# Altium project MPD_NEW.PrjPcb
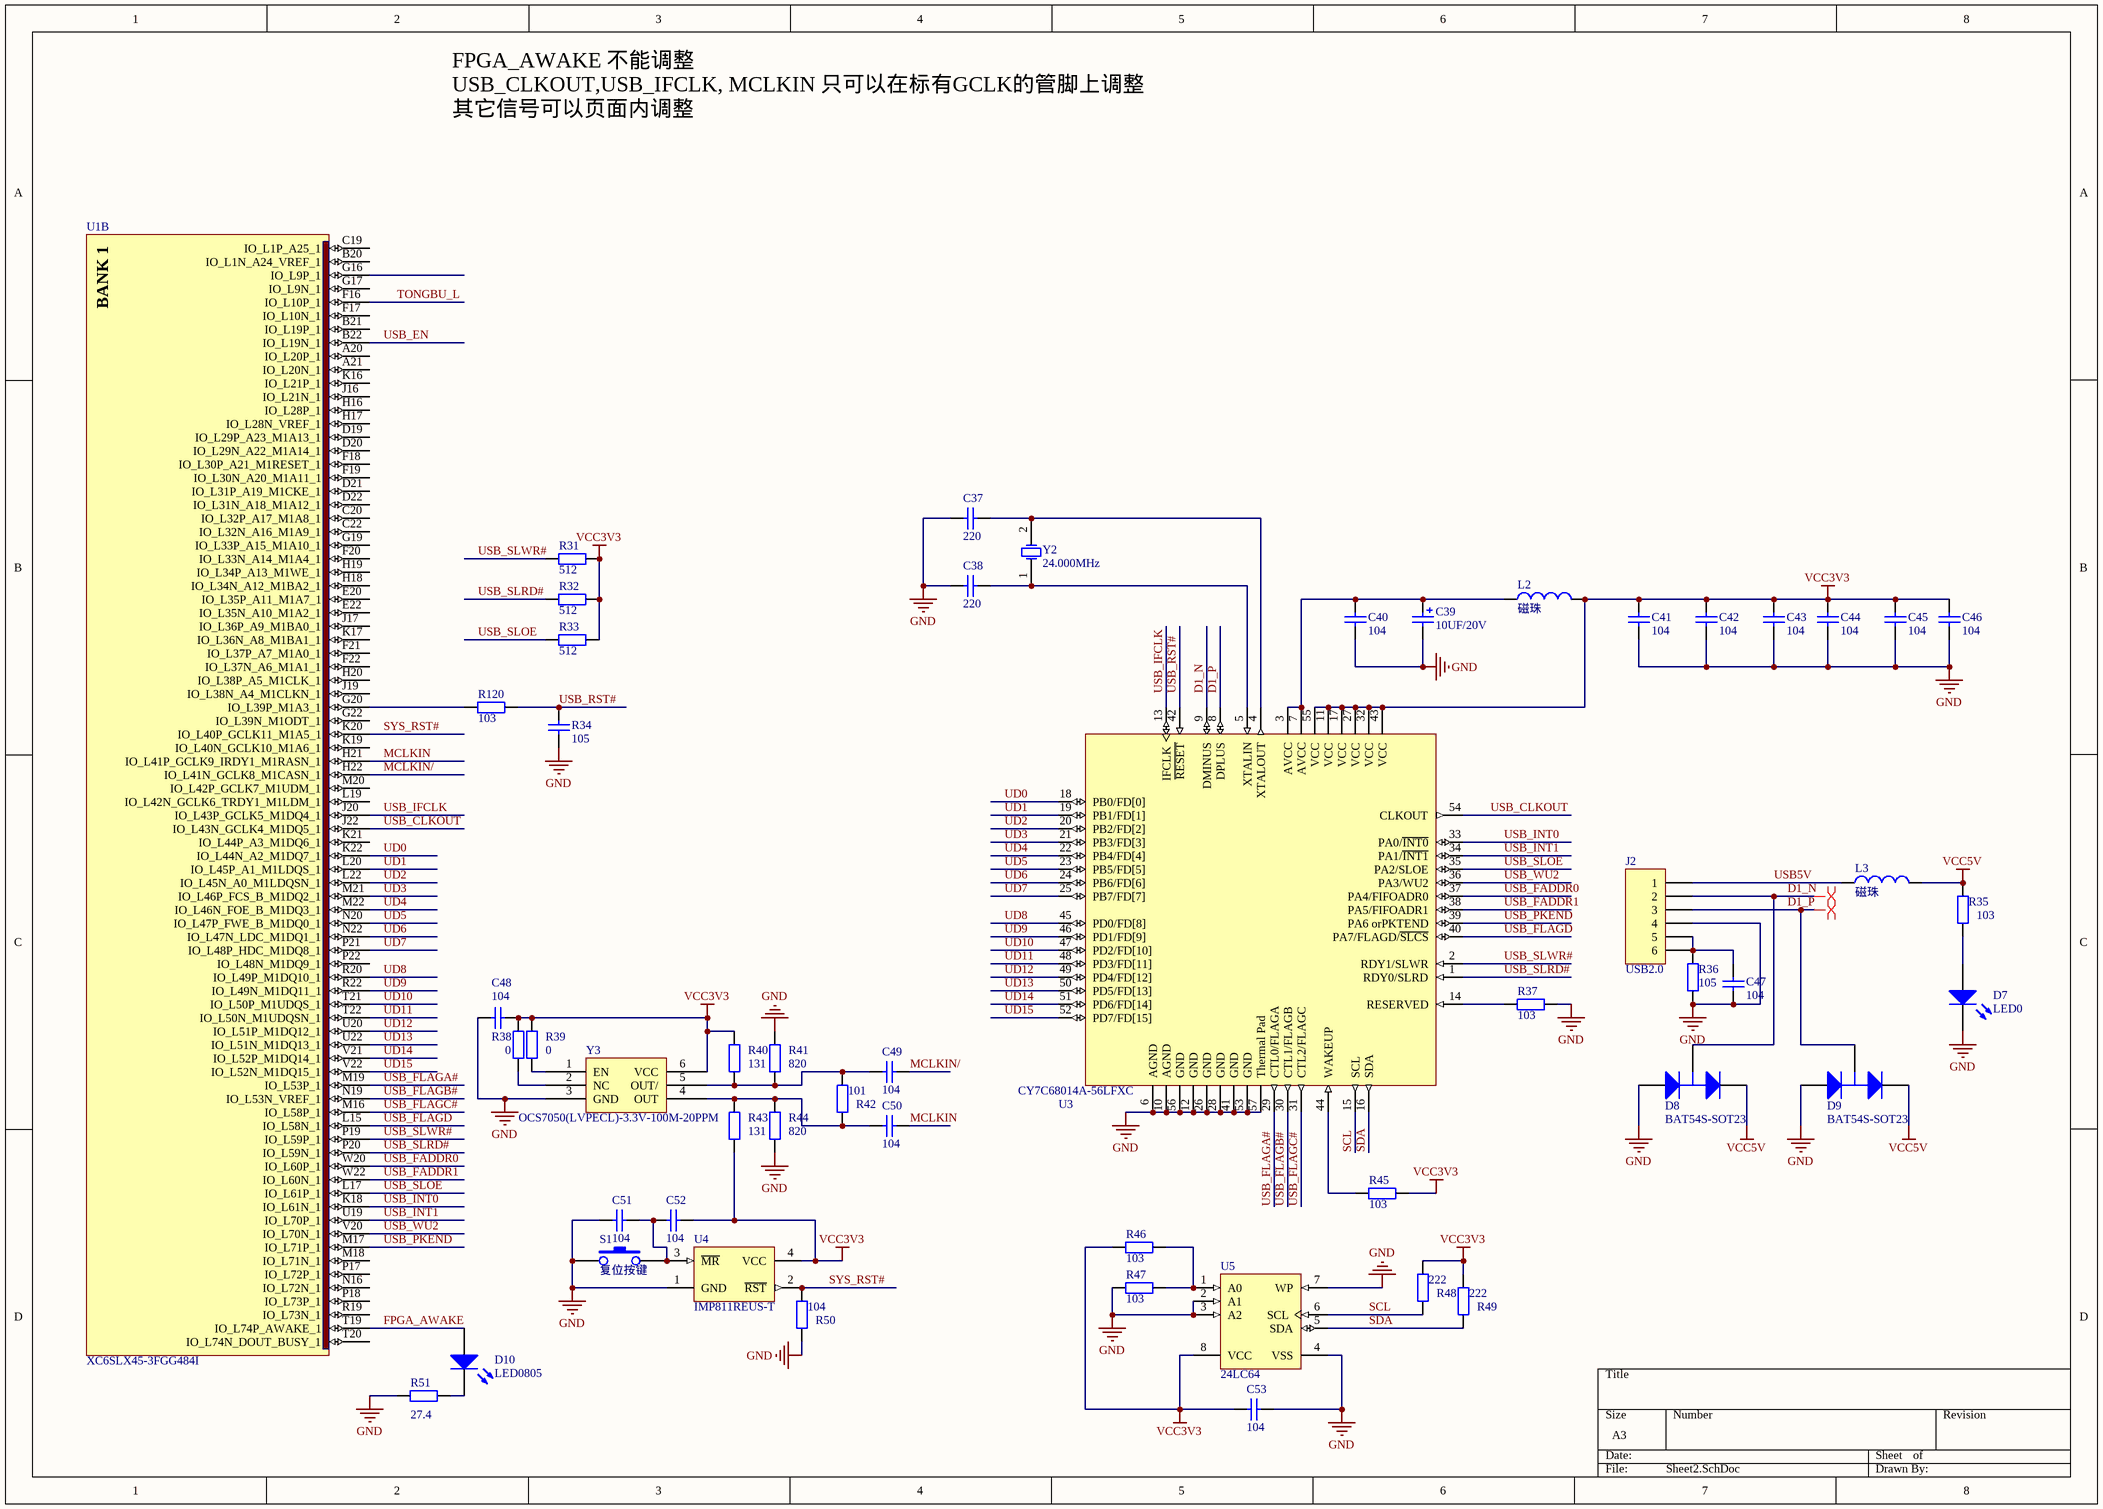
[diagram p0: Sheet2.SchDoc]
3 sheets, 260 parts. Net scope: global (net labels, ports and power ports of the same name join across sheets).
Board file: SD171-5.0PCB3.PcbDoc
Sheets:
  Sheet2.SchDoc
  Sheet3.SchDoc
  Sheet5.SchDoc

## Sheet Sheet2.SchDoc
size A3

### Parts
C37  220  [0402]
C38  220  [0402]
C39  10UF/20V  [CAP-B]
C40  104  [0402]
C41  104  [0402]
C42  104  [0402]
C43  104  [0402]
C44  104  [0402]
C45  104  [0402]
C46  104  [0402]
C47  104  [0402]
C48  104  [0402]
C49  104  [0402]
C50  104  [0402]
C51  104  [0402]
C52  104  [0402]
C53  104  [0402]
D7  LED0  [0805LED]
D8  BAT54S-SOT23  [SOT23-3L]
D9  BAT54S-SOT23  [SOT23-3L]
D10  LED0805  [0805LED]
J2  USB2.0  [USB-B]
L2  磁珠  [1206A]
L3  磁珠  [1206A]
R31  512  [0603]
R32  512  [0603]
R33  512  [0603]
R34  105  [0603X]
R35  103  [0603]
R36  105  [0603]
R37  103  [0603]
R38  0  [0603]
R39  0  [0603]
R40  131  [0603]
R41  820  [0603]
R42  101  [0603]
R43  131  [0603]
R44  820  [0603]
R45  103  [0603]
R46  103  [0603]
R47  103  [0603]
R48  222  [0603]
R49  222  [0603]
R50  104  [0603]
R51  27.4  [0603]
R120  103  [0603]
S1  复位按键  [RESETKEY]
U1  XC6SLX45-3FGG484I  [FGG484]  (part B of 8)
U3  CY7C68014A-56LFXC  [LF56A_N]
U4  IMP811REUS-T  [SOT-143]
U5  24LC64  [SMD8XX]
Y2  24.000MHz  [CRYSTAL_2]
Y3  OCS7050(LVPECL)-3.3V-100M-20PPM  [CCPD-940X-033]

### Nets
GND: C37.1 C38.1 C39.2 C40.1 C41.1 C42.1 C43.1 C44.1 C45.1 C46.1 C47.2 C48.2 C51.2 C53.1 D7.2(K) D8.1(A) D9.1(A) J2.4 R34.1 R36.1 R37.2 R41.2 R44.1 R47.2 R50.1 R51.1 S1.1 U3.6(AGND) U3.10(AGND) U3.12(GND) U3.26(GND) U3.28(GND) U3.41(GND) U3.53(GND) U3.56(GND) U3.57(Thermal_Pad) U4.1(GND) U5.2(A1) U5.3(A2) U5.4(VSS) U5.7(WP) Y3.3(GND)
VCC3V3: C41.2 C42.2 C43.2 C44.2 C45.2 C46.2 C48.1 C52.1 C53.2 L2.2 R31.1 R32.1 R33.1 R38.1 R39.1 R40.2 R43.1 R45.1 R46.2 R48.1 R49.1 U3.11(VCC) U3.17(VCC) U3.27(VCC) U3.32(VCC) U3.43(VCC) U3.55(VCC) U4.4(VCC) U5.8(VCC) Y3.6(VCC)
VCC5V: D8.2(K) D9.2(K) L3.2 R35.2
D1_N: D8.3(C) J2.2 U3.9(DMINUS)
D1_P: D9.3(C) J2.3 U3.8(DPLUS)
FPGA_AWAKE: D10.1(A) U1.T19(IO_L74P_AWAKE_1)
MCLKIN: C50.2 U1.H21(IO_L41P_GCLK9_IRDY1_M1RASN_1)
MCLKIN/: C49.2 U1.H22(IO_L41N_GCLK8_M1CASN_1)
SCL: R48.2 U3.15(SCL) U5.6(SCL)
SDA: R49.2 U3.16(SDA) U5.5(SDA)
SYS_RST#: R50.2 U1.K20(IO_L40P_GCLK11_M1A5_1) U4.2(~{RST})
TONGBU_L: U1.F16(IO_L10P_1)
UD0: U1.K22(IO_L44N_A2_M1DQ7_1) U3.18(PB0/FD[0])
UD1: U1.L20(IO_L45P_A1_M1LDQS_1) U3.19(PB1/FD[1])
UD2: U1.L22(IO_L45N_A0_M1LDQSN_1) U3.20(PB2/FD[2])
UD3: U1.M21(IO_L46P_FCS_B_M1DQ2_1) U3.21(PB3/FD[3])
UD4: U1.M22(IO_L46N_FOE_B_M1DQ3_1) U3.22(PB4/FD[4])
UD5: U1.N20(IO_L47P_FWE_B_M1DQ0_1) U3.23(PB5/FD[5])
UD6: U1.N22(IO_L47N_LDC_M1DQ1_1) U3.24(PB6/FD[6])
UD7: U1.P21(IO_L48P_HDC_M1DQ8_1) U3.25(PB7/FD[7])
UD8: U1.R20(IO_L49P_M1DQ10_1) U3.45(PD0/FD[8])
UD9: U1.R22(IO_L49N_M1DQ11_1) U3.46(PD1/FD[9])
UD10: U1.T21(IO_L50P_M1UDQS_1) U3.47(PD2/FD[10])
UD11: U1.T22(IO_L50N_M1UDQSN_1) U3.48(PD3/FD[11])
UD12: U1.U20(IO_L51P_M1DQ12_1) U3.49(PD4/FD[12])
UD13: U1.U22(IO_L51N_M1DQ13_1) U3.50(PD5/FD[13])
UD14: U1.V21(IO_L52P_M1DQ14_1) U3.51(PD6/FD[14])
UD15: U1.V22(IO_L52N_M1DQ15_1) U3.52(PD7/FD[15])
USB5V: J2.1 L3.1
USB_CLKOUT: U1.J22(IO_L43N_GCLK4_M1DQ5_1) U3.54(CLKOUT)
USB_EN: U1.B22(IO_L19N_1)
USB_FADDR0: U1.W20(IO_L60P_1) U3.37(PA4/FIFOADR0)
USB_FADDR1: U1.W22(IO_L60N_1) U3.38(PA5/FIFOADR1)
USB_FLAGA#: U1.M19(IO_L53P_1) U3.29(CTL0/FLAGA)
USB_FLAGB#: U1.N19(IO_L53N_VREF_1) U3.30(CTL1/FLAGB)
USB_FLAGC#: U1.M16(IO_L58P_1) U3.31(CTL2/FLAGC)
USB_FLAGD: U1.L15(IO_L58N_1) U3.40(PA7/FLAGD/~{SLCS})
USB_IFCLK: U1.J20(IO_L43P_GCLK5_M1DQ4_1) U3.13(IFCLK)
USB_INT0: U1.K18(IO_L61N_1) U3.33(PA0/~{INT0})
USB_INT1: U1.U19(IO_L70P_1) U3.34(PA1/~{INT1})
USB_PKEND: U1.M17(IO_L71P_1) U3.39(PA6_orPKTEND)
USB_RST#: R34.2 R120.1 U3.42(~{RESET})
USB_SLOE: R33.2 U1.L17(IO_L61P_1) U3.35(PA2/SLOE)
USB_SLRD#: R32.2 U1.P20(IO_L59N_1) U3.1(RDY0/SLRD)
USB_SLWR#: R31.2 U1.P19(IO_L59P_1) U3.2(RDY1/SLWR)
USB_WU2: U1.V20(IO_L70N_1) U3.36(PA3/WU2)
NetC37_2: C37.2 U3.4(XTALOUT) Y2.2(OSC2)
NetC38_2: C38.2 U3.5(XTALIN) Y2.1(OSC1)
NetC39_1: C39.1 C40.2 L2.1 U3.3(AVCC) U3.7(AVCC)
NetC47_1: C47.1 J2.5 J2.6 R36.2
NetC49_1: C49.1 R40.1 R41.1 R42.2 Y3.5(OUT/)
NetC50_1: C50.1 R42.1 R43.2 R44.2 Y3.4(OUT)
NetC51_1: C51.1 C52.2 S1.2 U4.3(~{MR})
NetD7_1: D7.1(A) R35.1
NetD10_2: D10.2(K) R51.2
NetR37_1: R37.1 U3.14(RESERVED)
NetR38_2: R38.2 Y3.2(NC)
NetR39_2: R39.2 Y3.1(EN)
NetR45_2: R45.2 U3.44(WAKEUP)
NetR46_1: R46.1 R47.1 U5.1(A0)
NetR120_2: R120.2 U1.G20(IO_L39P_M1A3_1)

Not connected (* = marked no-connect by the designer): U1 A20(IO_L20P_1) A21(IO_L20N_1) B20(IO_L1N_A24_VREF_1) B21(IO_L19P_1) C19(IO_L1P_A25_1) C20(IO_L32P_A17_M1A8_1) C22(IO_L32N_A16_M1A9_1) D19(IO_L29P_A23_M1A13_1) D20(IO_L29N_A22_M1A14_1) D21(IO_L31P_A19_M1CKE_1) D22(IO_L31N_A18_M1A12_1) E20(IO_L35P_A11_M1A7_1) E22(IO_L35N_A10_M1A2_1) F17(IO_L10N_1) F18(IO_L30P_A21_M1RESET_1) F19(IO_L30N_A20_M1A11_1) F20(IO_L33N_A14_M1A4_1) F21(IO_L37P_A7_M1A0_1) F22(IO_L37N_A6_M1A1_1) G16(IO_L9P_1) G17(IO_L9N_1) G19(IO_L33P_A15_M1A10_1) G22(IO_L39N_M1ODT_1) H16(IO_L28P_1) H17(IO_L28N_VREF_1) H18(IO_L34N_A12_M1BA2_1) H19(IO_L34P_A13_M1WE_1) H20(IO_L38P_A5_M1CLK_1) J16(IO_L21N_1) J17(IO_L36P_A9_M1BA0_1) J19(IO_L38N_A4_M1CLKN_1) K16(IO_L21P_1) K17(IO_L36N_A8_M1BA1_1) K19(IO_L40N_GCLK10_M1A6_1) K21(IO_L44P_A3_M1DQ6_1) L19(IO_L42N_GCLK6_TRDY1_M1LDM_1) M18(IO_L71N_1) M20(IO_L42P_GCLK7_M1UDM_1) N16(IO_L72N_1) P17(IO_L72P_1) P18(IO_L73P_1) P22(IO_L48N_M1DQ9_1) R19(IO_L73N_1) T20(IO_L74N_DOUT_BUSY_1)

### Layout directives
differential pair: D1_N, D1_P

### Notes on the sheet
- FPGA_AWAKE 不能调整
  USB_CLKOUT,USB_IFCLK, MCLKIN 只可以在标有GCLK的管脚上调整
  其它信号可以页面内调整
- (in symbol XC6SLX45-3FGG484I, part B) BANK 1

### Library data of the parts
C37 C38 R34 = Cap: Capacitor; Value: 22pF; Published: 8-Jun-2000; LatestRevisionDate: 17-Jul-2002; LatestRevisionNote: Re-released for DXP Platform.; PackageReference: RAD-0.3; Publisher: Altium Limited
C39 = Cap Pol2: Polarized Capacitor (Axial); Value: 100pF; Published: 8-Jun-2000; LatestRevisionDate: 17-Jul-2002; LatestRevisionNote: Re-released for DXP Platform.; PackageReference: POLAR0.8; Publisher: Altium Limited
C40 = Cap: Capacitor; Value: 100pF; Published: 8-Jun-2000; LatestRevisionDate: 17-Jul-2002; LatestRevisionNote: Re-released for DXP Platform.; PackageReference: RAD-0.3; Publisher: Altium Limited
C41-C53 = Cap: Capacitor; Value: 0.1uF; Published: 8-Jun-2000; LatestRevisionDate: 17-Jul-2002; LatestRevisionNote: Re-released for DXP Platform.; PackageReference: RAD-0.3; Publisher: Altium Limited
D7 D10 = LED0: Typical INFRARED GaAs LED; Published: 8-Jun-2000; LatestRevisionDate: 08-Jul-2005; LatestRevisionNote: Mech Layer 1 removed.; PackageReference: LED-0; Publisher: Altium Limited
D8 D9 = BAV99: Silicon Switching Diode Array for High-Speed Switching; Published: 21-Mar-2003; DatasheetDocument: Oct-1999; PackageDocument: Sep-2001; PackageReference: SOT-23; Publisher: Altium Limited; ComponentLink1Description: Manufacturer Link; ComponentLink1URL: http://www.infineon.com/; ComponentLink2Description: Datasheet; ComponentLink2URL: http://www.infineon.com/upload/Document/cmc_upload/documents/080/631/bav99series_1.pdf
J2 = Header 6: Header, 6-Pin; LatestRevisionDate: 17-Jul-2002; LatestRevisionNote: Re-released for DXP Platform.; Publisher: Altium Limited
L2 L3 = Inductor: Code_IEC: 1005; Published: 8-Jun-2000; LatestRevisionDate: 29-May-2009; LatestRevisionNote: IPC-7351 Footprint Added.; PackageReference: 0402-A; Publisher: Altium Limited; PackageDescription: Chip Inductor; Code_JEITA: 0402
R31-R33 R38-R44 R50 R120 = Res2: Resistor; Value: 100K; Published: 8-Jun-2000; LatestRevisionDate: 17-Jul-2002; LatestRevisionNote: Re-released for DXP Platform.; PackageReference: AXIAL-0.4; Publisher: Altium Limited
R35-R37 R45-R47 = Res2: Resistor; Value: 10K; Published: 8-Jun-2000; LatestRevisionDate: 17-Jul-2002; LatestRevisionNote: Re-released for DXP Platform.; PackageReference: AXIAL-0.4; Publisher: Altium Limited
R48 R49 = Res2: Resistor; Value: 2.2K; Published: 8-Jun-2000; LatestRevisionDate: 17-Jul-2002; LatestRevisionNote: Re-released for DXP Platform.; PackageReference: AXIAL-0.4; Publisher: Altium Limited
R51 = Res2: Resistor; Published: 8-Jun-2000; LatestRevisionDate: 17-Jul-2002; LatestRevisionNote: Re-released for DXP Platform.; PackageReference: AXIAL-0.4; Publisher: Altium Limited; Value: 27.4
S1 = SW-PB
U1 = XC6SLX45-3FGG484I: Spartan-6 LX 1.2V FPGA, 316 User I/Os, 484-Ball Fine-Pitch BGA (1.0mm Pitch), Speed Grade 3, Industrial Grade, Pb-Free; FirstPublished: 17-Nov-2009; DatasheetVersion: ver1.3, Nov-2009; PackageVersion: ver1.1, Dec-2008; PackageReference: FGG484; Publisher: Altium Limited; PackageDescription: 484-Ball Fine Pitch Ball Grid Array 1.00 mm Pitch (FGG484) - Pb-Free; Code_JEDEC: MS-034-AAJ-1; Code_IPC: BGA100P22X22-484; ComponentLink1Description: Spartan-6 Datasheet; ComponentLink1URL: http://www.xilinx.com/support/documentation/data_sheets/ds160.pdf; ComponentLink2Description: Pinout Specification; ComponentLink2URL: http://www.xilinx.com/support/documentation/user_guides/ug385.pdf; ComponentLink3Description: FGG484 Package Drawing; ComponentLink3URL: http://www.xilinx.com/support/documentation/package_specs/fg484.pdf; ComponentLink4Description: Spartan-6 Documents; ComponentLink4URL: http://www.xilinx.com/support/documentation/spartan-6.htm; ComponentLink5Description: Xilinx.com Home; ComponentLink5URL: http://www.xilinx.com
U3 = CY7C68014A-56LFXC: EZ-USB FX2LP USB Microcontroller Ideal for Battery Powered Applications,16K RAM, 24 I/Os, 56-Pin QFN, Pb-Free, Commercial Grade; Published: 16-Dec-2005; LatestRevisionDate: 13-Apr-2006; LatestRevisionNote: IPC-7351 Footprint Added.; DatasheetVersion: rev.J, Sep-2005; PackageVersion: May-2003; PackageReference: LF56A; Publisher: Altium Limited; PackageDescription: 56-Pin Punch Version Quad Flat No-Lead 0.5 mm Pitch; Code_JEDEC: MO-220; ComponentLink1Description: Manufacturer Link; ComponentLink1URL: http://www.cypress.com/portal/server.pt; ComponentLink2Description: Datasheet; ComponentLink2URL: http://www.cypress.com/portal/server.pt/gateway/PTARGS_0_2_1524_209_259_43/http%3B/sjapp20.mis.cypress.com%3B7001/publishedcontent/publish/design_resources/datasheets/contents/cy7c68014a_5.pdf
U4 = MAX811-EUS-T: 4-Pin µP Voltage Monitors with Manual Reset Input; Published: 16-Jan-2001; LatestRevisionDate: 29-May-2009; LatestRevisionNote: IPC-7351 Footprint Added.; DatasheetVersion: Feb-1998; PackageVersion: Feb-1998; PackageReference: SOT143; Publisher: Altium Limited; PackageDescription: 4-Pin SOT-143 Package 1.9 mm Pitch, 2.3 mm Lead Span; ComponentLink1Description: Manufacturer Link; ComponentLink1URL: http://www.maxim-ic.com/; ComponentLink2Description: Datasheet; ComponentLink2URL: http://pdfserv.maxim-ic.com/en/ds/MAX811-MAX812.pdf
U5 = 24LC02B-I/SN: 2Kbit, 400kHz, 2.5V, I2C Serial EEPROM, 8-Pin SOIC 150mil, Industrial Temperature; FirstPublished: 29-Jan-2009; DatasheetVersion: revJ, Feb-2009; PackageVersion: revBB, Aug-2009; PackageReference: SOIC-SN8; Publisher: Altium Limited; PackageDescription: 8-Lead Plastic Small Outline (SN) - Narrow, 3.90mm Body [SOIC]; Supplier 1: Digi-Key; Supplier Part Number 1: 24LC02B-I/SN-ND; Supplier 2: Farnell; Supplier Part Number 2: 1196818; Supplier 3: Newark; Supplier Part Number 3: 12C1997; Code_JEDEC: MS-012; Code_IPC: SOIC127P600-8; ComponentLink1Description: Datasheet; ComponentLink1URL: http://ww1.microchip.com/downloads/en/DeviceDoc/21709J.pdf; ComponentLink2Description: Packaging Specification; ComponentLink2URL: http://www.microchip.com/stellent/groups/techpub_sg/documents/packagingspec/en012702.pdf; ComponentLink3Description: Microchip.com Home; ComponentLink3URL: http://www.microchip.com/
Y2 = XTAL: Crystal Oscillator; Published: 8-Jun-2000; LatestRevisionDate: 17-Jul-2002; LatestRevisionNote: Re-released for DXP Platform.; PackageReference: R38; Publisher: Altium Limited
Y3 = Component_1

## Sheet Sheet3.SchDoc
size A3
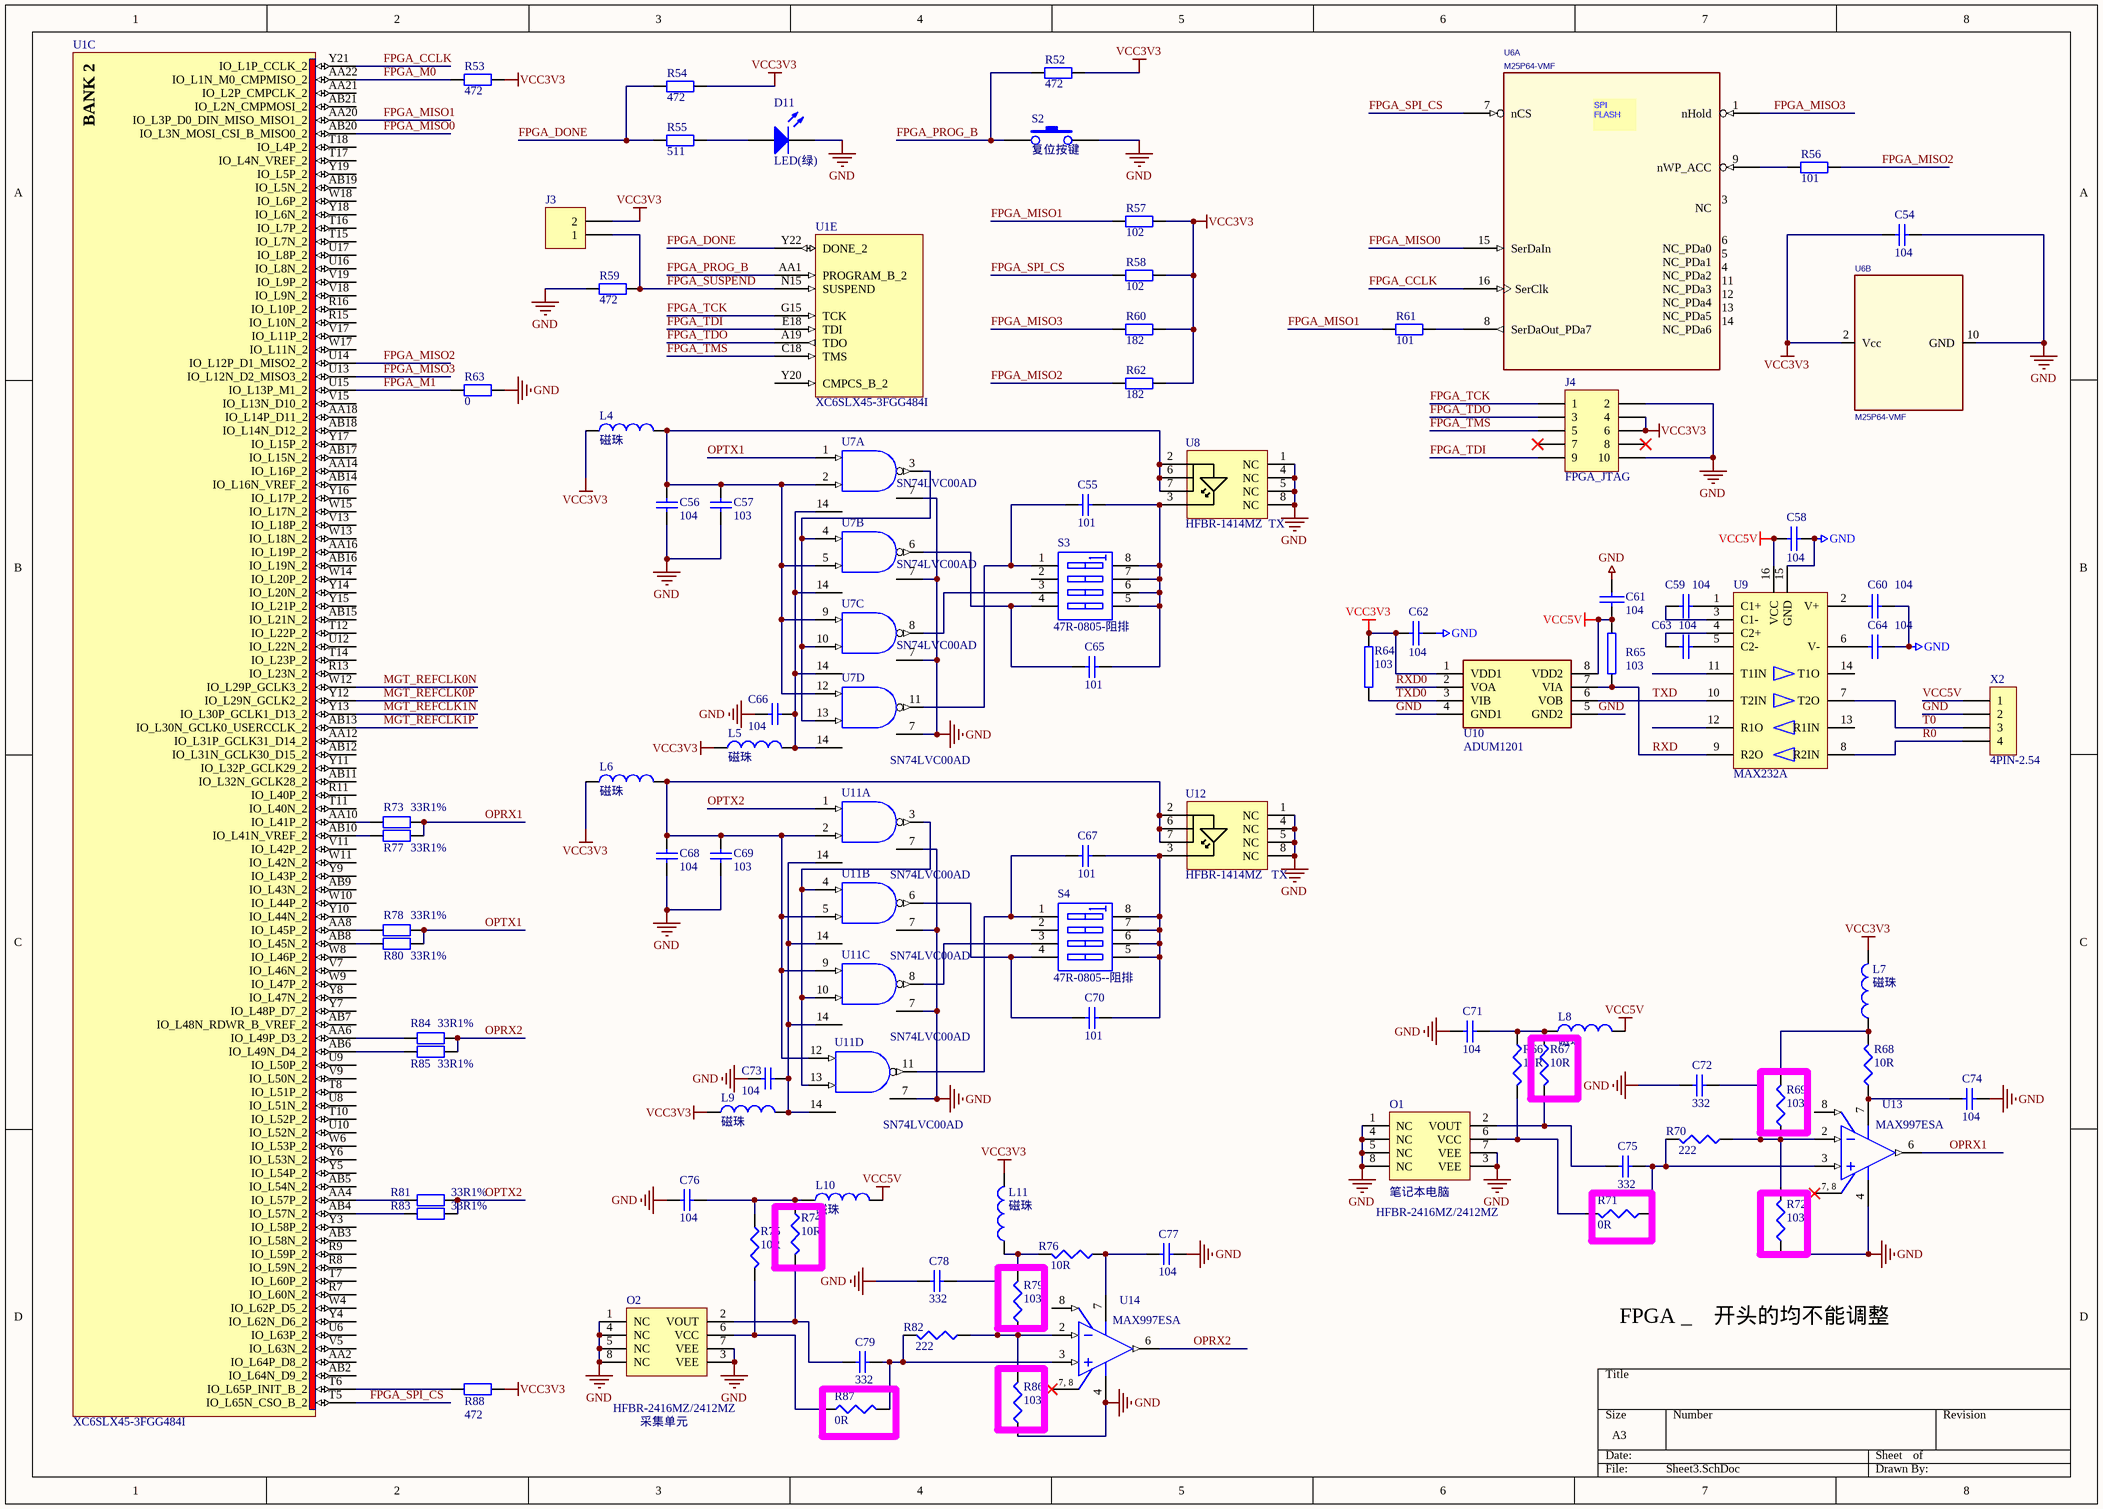
[diagram p1: Sheet3.SchDoc]

### Parts
C54  104  [0402]
C55  101  [0603]
C56  104  [0603]
C57  103  [0603]
C58  104  [0603]
C59  104  [0603]
C60  104  [0603]
C61  104  [0603]
C62  104  [0603]
C63  104  [0603]
C64  104  [0603]
C65  101  [0603]
C66  104  [0603]
C67  101  [0603]
C68  104  [0603]
C69  103  [0603]
C70  101  [0603]
C71  104  [0603]
C72  332  [0603]
C73  104  [0603]
C74  104  [0603]
C75  332  [0603]
C76  104  [0603]
C77  104  [0603]
C78  332  [0603]
C79  332  [0603]
D11  LED(绿)  [0805LED]
J3  (no value)  [HDR1X2]
J4  FPGA_JTAG  [HDR2X5]
L4  磁珠  [1206A]
L5  磁珠  [1206A]
L6  磁珠  [1206A]
L7  磁珠  [1206A]
L8  磁珠  [1206A]
L9  磁珠  [1206A]
L10  磁珠  [1206A]
L11  磁珠  [1206A]
O1  HFBR-2416MZ/2412MZ  [OPT]
O2  HFBR-2416MZ/2412MZ  [OPT]
R52  472  [0603]
R53  472  [0603]
R54  472  [0603]
R55  511  [0603]
R56  101  [0603]
R57  102  [0603]
R58  102  [0603]
R59  472  [0603]
R60  182  [0603]
R61  101  [0603]
R62  182  [0603]
R63  0  [0603]
R64  103  [0603]
R65  103  [0603]
R66  10R  [0603]
R67  10R  [0603]
R68  10R  [0603]
R69  103  [0603]
R70  222  [0603]
R71  0R  [0603]
R72  103  [0603]
R73  33R1%  [0402]
R74  10R  [0603]
R75  10R  [0603]
R76  10R  [0603]
R77  33R1%  [0402]
R78  33R1%  [0402]
R79  103  [0603]
R80  33R1%  [0402]
R81  33R1%  [0402]
R82  222  [0603]
R83  33R1%  [0402]
R84  33R1%  [0402]
R85  33R1%  [0402]
R86  103  [0603]
R87  0R  [0603]
R88  472  [0603]
S2  复位按键  [RESETKEY]
S3  47R-0805-阻排  [RNS001]
S4  47R-0805--阻排  [RNS001]
U1  XC6SLX45-3FGG484I  [FGG484]  (parts C,E of 8)
U6  M25P64-VMF  [SOIC16]  (parts A,B of 2)
U7  SN74LVC00AD  [SMD14X]  (parts A,B,C,D of 4)
U8  HFBR-1414MZ  TX  [OPT]
U9  MAX232A  [SMD16XX]
U10  ADUM1201  [SMD8XX]
U11  SN74LVC00AD  [SMD14X]  (parts A,B,C,D of 4)
U12  HFBR-1414MZ   TX  [OPT]
U13  MAX997ESA  [SMD8XX]
U14  MAX997ESA  [SMD8XX]
X2  4PIN-2.54  [SIP4X]

### Nets
GND: C54.1 C56.2 C57.1 C58.1 C60.1 C61.2 C62.2 C64.1 C66.2 C68.2 C69.1 C71.2 C72.2 C73.2 C74.2 C76.2 C77.2 C78.2 D11.2(K) J4.2 J4.10 O1.1(NC) O1.3(VEE) O1.4(NC) O1.5(NC) O1.7(VEE) O1.8(NC) O2.1(NC) O2.3(VEE) O2.4(NC) O2.5(NC) O2.7(VEE) O2.8(NC) R59.1 R63.2 R72.1 R86.1 S2.2 U6.10(GND) U7.7(GND) U8.1(NC) U8.4(NC) U8.5(NC) U8.8(NC) U9.15(GND) U10.4(GND1) U10.5(GND2) U11.7(GND) U12.1(NC) U12.4(NC) U12.5(NC) U12.8(NC) U13.4(GND) U14.4(GND) X2.2
VCC: C66.1 C73.1 L5.2 L9.2 U7.14(VCC) U11.14(VCC)
VCC3V3: C54.2 C62.1 J3.2 J4.4 J4.6 L4.1 L5.1 L6.1 L7.2 L9.1 L11.2 R52.2 R53.2 R54.2 R57.2 R58.2 R60.2 R62.2 R64.2 R88.2 U6.2(Vcc) U10.1(VDD1)
VCC5V: C58.2 C61.1 L8.2 L10.2 R65.2 U9.16(VCC) U10.8(VDD2) X2.1
FPGA_CCLK: U1.Y21(IO_L1P_CCLK_2) U6.16(SerClk)
FPGA_DONE: R54.1 R55.1 U1.Y22(DONE_2)
FPGA_M0: R53.1 U1.AA22(IO_L1N_M0_CMPMISO_2)
FPGA_M1: R63.1 U1.U15(IO_L13P_M1_2)
FPGA_MISO0: U1.AB20(IO_L3N_MOSI_CSI_B_MISO0_2) U6.15(SerDaIn)
FPGA_MISO1: R57.1 R61.1 U1.AA20(IO_L3P_D0_DIN_MISO_MISO1_2)
FPGA_MISO2: R56.2 R62.1 U1.U14(IO_L12P_D1_MISO2_2)
FPGA_MISO3: R60.1 U1.U13(IO_L12N_D2_MISO3_2) U6.1(nHold)
FPGA_PROG_B: R52.1 S2.1 U1.AA1(PROGRAM_B_2)
FPGA_SPI_CS: R58.1 U1.T5(IO_L65N_CSO_B_2) U6.7(nCS)
FPGA_SUSPEND: J3.1 R59.2 U1.N15(SUSPEND)
FPGA_TCK: J4.1 U1.G15(TCK)
FPGA_TDI: J4.9 U1.E18(TDI)
FPGA_TDO: J4.3 U1.A19(TDO)
FPGA_TMS: J4.5 U1.C18(TMS)
MGT_REFCLK0N: U1.W12(IO_L29P_GCLK3_2)
MGT_REFCLK0P: U1.Y12(IO_L29N_GCLK2_2)
MGT_REFCLK1N: U1.Y13(IO_L30P_GCLK1_D13_2)
MGT_REFCLK1P: U1.AB13(IO_L30N_GCLK0_USERCCLK_2)
OPRX1: R73.1 R77.1 U13.6(OUT)
OPRX2: R84.1 R85.1 U14.6(OUT)
OPTX1: R78.1 R80.1 U7.1(A)
OPTX2: R81.1 R83.1 U11.1(A)
R0: U9.8(R2IN) X2.4
RXD: R65.1 U9.9(R2O) U10.7(VIA)
RXD0: U10.2(VOA)
T0: U9.7(T2O) X2.3
TXD: U9.10(T2IN) U10.6(VOB)
TXD0: R64.1 U10.3(VIB)
NetC55_1: C55.1 C65.1 S3.5(B4) S3.6(B3) S3.7(B2) S3.8(B1) U8.3
NetC55_2: C55.2 S3.1(A1) U7.11(Y)
NetC56_1: C56.1 C57.2 L4.2 U7.2(B) U7.5(B) U7.9(A) U7.12(A) U8.2 U8.6 U8.7
NetC59_1: C59.1 U9.1(C1+)
NetC59_2: C59.2 U9.3(C1-)
NetC60_2: C60.2 U9.2(V+)
NetC63_1: C63.1 U9.5(C2-)
NetC63_2: C63.2 U9.4(C2+)
NetC64_2: C64.2 U9.6(V-)
NetC65_2: C65.2 S3.4(A4) U7.6(Y)
NetC67_1: C67.1 C70.1 S4.5(B4) S4.6(B3) S4.7(B2) S4.8(B1) U12.3
NetC67_2: C67.2 S4.1(A1) U11.11(Y)
NetC68_1: C68.1 C69.2 L6.2 U11.2(B) U11.5(B) U11.9(A) U11.12(A) U12.2 U12.6 U12.7
NetC70_2: C70.2 S4.4(A4) U11.6(Y)
NetC71_1: C71.1 L8.1 R66.1 R67.1
NetC72_1: C72.1 R69.1 R70.1 R72.2 U13.2(IN-)
NetC74_1: C74.1 R68.1 U13.7(VCC)
NetC75_1: C75.1 R70.2 R71.1 U13.3(IN+)
NetC75_2: C75.2 O1.2(VOUT) R67.2
NetC76_1: C76.1 L10.1 R74.1 R75.1
NetC77_1: C77.1 R76.1 U14.7(VCC)
NetC78_1: C78.1 R79.1 R82.1 R86.2 U14.2(IN-)
NetC79_1: C79.1 R82.2 R87.2 U14.3(IN+)
NetC79_2: C79.2 O2.2(VOUT) R74.2
NetD11_1: D11.1(A) R55.2
NetL7_1: L7.1 R68.2 R69.2
NetL11_1: L11.1 R76.2 R79.2
NetO1_6: O1.6(VCC) R66.2 R71.2
NetO2_6: O2.6(VCC) R75.2 R87.1
NetR56_1: R56.1 U6.9(nWP_ACC)
NetR61_2: R61.2 U6.8(SerDaOut_PDa7)
NetR73_2: R73.2 U1.AA10(IO_L41P_2)
NetR77_2: R77.2 U1.AB10(IO_L41N_VREF_2)
NetR78_2: R78.2 U1.AA8(IO_L45P_2)
NetR80_2: R80.2 U1.AB8(IO_L45N_2)
NetR81_2: R81.2 U1.AA4(IO_L57P_2)
NetR83_2: R83.2 U1.AB4(IO_L57N_2)
NetR84_2: R84.2 U1.AA6(IO_L49P_D3_2)
NetR85_2: R85.2 U1.AB6(IO_L49N_D4_2)
NetR88_1: R88.1 U1.T6(IO_L65P_INIT_B_2)
NetS3_3: S3.3(A3) U7.8(Y)
NetS4_3: S4.3(A3) U11.8(Y)
NetU7_3: U7.3(Y) U7.4(A) U7.10(B) U7.13(B)
NetU11_3: U11.3(Y) U11.4(A) U11.10(B) U11.13(B)
NetU13_1: U13.1(NC) U13.5(NC)
NetU14_1: U14.1(NC) U14.5(NC)

Not connected (* = marked no-connect by the designer): J4 7* 8*; S3 2(A2); S4 2(A2); U1 AA2(IO_L64P_D8_2) AA12(IO_L31P_GCLK31_D14_2) AA14(IO_L16P_2) AA16(IO_L19P_2) AA18(IO_L14P_D11_2) AA21(IO_L2P_CMPCLK_2) AB2(IO_L64N_D9_2) AB3(IO_L58N_2) AB5(IO_L54N_2) AB7(IO_L48N_RDWR_B_VREF_2) AB9(IO_L43N_2) AB11(IO_L32N_GCLK28_2) AB12(IO_L31N_GCLK30_D15_2) AB14(IO_L16N_VREF_2) AB15(IO_L21N_2) AB16(IO_L19N_2) AB17(IO_L15N_2) AB18(IO_L14N_D12_2) AB19(IO_L5N_2) AB21(IO_L2N_CMPMOSI_2) R7(IO_L60N_2) R8(IO_L59N_2) R9(IO_L59P_2) R11(IO_L40P_2) R13(IO_L23N_2) R15(IO_L10N_2) R16(IO_L10P_2) T7(IO_L60P_2) T8(IO_L51P_2) T10(IO_L52P_2) T11(IO_L40N_2) T12(IO_L22P_2) T14(IO_L23P_2) T15(IO_L7N_2) T16(IO_L7P_2) T17(IO_L4N_VREF_2) T18(IO_L4P_2) U6(IO_L63P_2) U8(IO_L51N_2) U9(IO_L50P_2) U10(IO_L52N_2) U12(IO_L22N_2) U16(IO_L8N_2) U17(IO_L8P_2) V5(IO_L63N_2) V7(IO_L46N_2) V9(IO_L50N_2) V11(IO_L42P_2) V13(IO_L18P_2) V15(IO_L13N_D10_2) V17(IO_L11P_2) V18(IO_L9N_2) V19(IO_L9P_2) W4(IO_L62P_D5_2) W6(IO_L53P_2) W8(IO_L46P_2) W9(IO_L47P_2) W10(IO_L44P_2) W11(IO_L42N_2) W13(IO_L18N_2) W14(IO_L20P_2) W15(IO_L17N_2) W17(IO_L11N_2) W18(IO_L6P_2) Y3(IO_L58P_2) Y4(IO_L62N_D6_2) Y5(IO_L54P_2) Y6(IO_L53N_2) Y7(IO_L48P_D7_2) Y8(IO_L47N_2) Y9(IO_L43P_2) Y10(IO_L44N_2) Y11(IO_L32P_GCLK29_2) Y14(IO_L20N_2) Y15(IO_L21P_2) Y16(IO_L17P_2) Y17(IO_L15P_2) Y18(IO_L6N_2) Y19(IO_L5P_2) Y20(CMPCS_B_2); U6 3(NC) 4(NC_PDa2) 5(NC_PDa1) 6(NC_PDa0) 11(NC_PDa3) 12(NC_PDa4) 13(NC_PDa5) 14(NC_PDa6); U9 11(T1IN) 12(R1O) 13(R1IN) 14(T1O); U13 8(~{SHDN}); U14 8(~{SHDN})

### Notes on the sheet
- (near O1) 笔记本电脑
- FPGA _    开头的均不能调整
- 采集单元
- (in symbol MAX998ESA) 7, 8
- (in symbol SPI FLASH 128Mb S25FL128P, part A) SPI / FLASH
- (in symbol XC6SLX45-3FGG484I, part C) BANK 2

### Library data of the parts
C54 C66 C73 C74 C77 = Cap: Capacitor; Value: 0.1uF; Published: 8-Jun-2000; LatestRevisionDate: 17-Jul-2002; LatestRevisionNote: Re-released for DXP Platform.; PackageReference: RAD-0.3; Publisher: Altium Limited
C55 C65 C67 C70 = Cap Semi: Capacitor (Semiconductor SIM Model); Value: ?uF; Published: 8-Jun-2000; LatestRevisionDate: 29-May-2009; LatestRevisionNote: IPC-7351 Footprint Added.; PackageReference: C1206; Publisher: Altium Limited; PackageDescription: Chip Capacitor
C56 C57 C68 C69 = Cap Semi: Capacitor (Semiconductor SIM Model); Value: ?pF; Published: 8-Jun-2000; LatestRevisionDate: 29-May-2009; LatestRevisionNote: IPC-7351 Footprint Added.; PackageReference: C1206; Publisher: Altium Limited; PackageDescription: Chip Capacitor
C58-C64 = CAP: Capacitor
C71 C72 C75 C76 C78 C79 = Cap: Capacitor; Value: ?pF; Published: 8-Jun-2000; LatestRevisionDate: 17-Jul-2002; LatestRevisionNote: Re-released for DXP Platform.; PackageReference: RAD-0.3; Publisher: Altium Limited
D11 = LED0: Typical INFRARED GaAs LED; Published: 8-Jun-2000; LatestRevisionDate: 08-Jul-2005; LatestRevisionNote: Mech Layer 1 removed.; PackageReference: LED-0; Publisher: Altium Limited
J3 = Header 2: Header, 2-Pin; LatestRevisionDate: 17-Jul-2002; LatestRevisionNote: Re-released for DXP Platform.; Publisher: Altium Limited
J4 = Header 5X2: Header, 5-Pin, Dual row; LatestRevisionDate: 17-Jul-2002; LatestRevisionNote: Re-released for DXP Platform.; Publisher: Altium Limited
L4-L11 = Inductor: Code_IEC: 1005; Value: 1uH 磁珠; Published: 8-Jun-2000; LatestRevisionDate: 29-May-2009; LatestRevisionNote: IPC-7351 Footprint Added.; PackageReference: 0402-A; Publisher: Altium Limited; PackageDescription: Chip Inductor; Code_JEITA: 0402
O1 O2 = OPTO
R52-R54 R59 R63 R88 = Res2: Resistor; Value: 4K7; Published: 8-Jun-2000; LatestRevisionDate: 17-Jul-2002; LatestRevisionNote: Re-released for DXP Platform.; PackageReference: AXIAL-0.4; Publisher: Altium Limited
R55 = Res2: Resistor; Value: 510; Published: 8-Jun-2000; LatestRevisionDate: 17-Jul-2002; LatestRevisionNote: Re-released for DXP Platform.; PackageReference: AXIAL-0.4; Publisher: Altium Limited
R56 R61 = Res2: Resistor; Value: 100R; Published: 8-Jun-2000; LatestRevisionDate: 17-Jul-2002; LatestRevisionNote: Re-released for DXP Platform.; PackageReference: AXIAL-0.4; Publisher: Altium Limited
R57 = Res2: Resistor; Value: DNP; Published: 8-Jun-2000; LatestRevisionDate: 17-Jul-2002; LatestRevisionNote: Re-released for DXP Platform.; PackageReference: AXIAL-0.4; Publisher: Altium Limited
R58 = Res2: Resistor; Value: 1K; Published: 8-Jun-2000; LatestRevisionDate: 17-Jul-2002; LatestRevisionNote: Re-released for DXP Platform.; PackageReference: AXIAL-0.4; Publisher: Altium Limited
R60 R62 = Res2: Resistor; Value: 1.8K; Published: 8-Jun-2000; LatestRevisionDate: 17-Jul-2002; LatestRevisionNote: Re-released for DXP Platform.; PackageReference: AXIAL-0.4; Publisher: Altium Limited
R64 R65 = RES2
R66-R68 R74-R76 = Res3: Resistor; Published: 8-Jun-2000; LatestRevisionDate: 29-May-2009; LatestRevisionNote: IPC-7351 Footprint Added.; PackageReference: J1-0603; Publisher: Altium Limited; PackageDescription: Chip Resistor; Value: 10R
R69 R71 R72 R79 R86 R87 = Res3: Resistor; Value: 10R; Published: 8-Jun-2000; LatestRevisionDate: 29-May-2009; LatestRevisionNote: IPC-7351 Footprint Added.; PackageReference: J1-0603; Publisher: Altium Limited; PackageDescription: Chip Resistor
R70 R82 = Res3: Resistor; Value: 2.2K; Published: 8-Jun-2000; LatestRevisionDate: 29-May-2009; LatestRevisionNote: IPC-7351 Footprint Added.; PackageReference: J1-0603; Publisher: Altium Limited; PackageDescription: Chip Resistor
R73 R77 R78 R80 R81 R83-R85 = Res2: Resistor; Value: 33R; Published: 8-Jun-2000; LatestRevisionDate: 17-Jul-2002; LatestRevisionNote: Re-released for DXP Platform.; PackageReference: AXIAL-0.4; Publisher: Altium Limited
S2 = SW-PB
S3 S4 = SW DIP-4: DIP Switch, 4 Position, SPST; Published: 24-Mar-1999; LatestRevisionDate: 29-May-2009; LatestRevisionNote: IPC-7351 Footprint Added.; PackageVersion: Dec-2002; PackageReference: SO8; Publisher: Altium Limited; PackageDescription: 8-Pin Small Outline Integrated Circuit 1.27 mm Pitch; Code_JEDEC: MS-012-AA; Code_IPC: SOIC127P600-8
U1 = XC6SLX45-3FGG484I: as U1 on sheet Sheet2; FirstPublished: 17-Nov-2009; DatasheetVersion: ver1.3, Nov-2009; PackageVersion: ver1.1, Dec-2008; PackageReference: FGG484; Publisher: Altium Limited; PackageDescription: 484-Ball Fine Pitch Ball Grid Array 1.00 mm Pitch (FGG484) - Pb-Free; Code_JEDEC: MS-034-AAJ-1; Code_IPC: BGA100P22X22-484; ComponentLink1Description: Spartan-6 Datasheet; ComponentLink1URL: http://www.xilinx.com/support/documentation/data_sheets/ds160.pdf; ComponentLink2Description: Pinout Specification; ComponentLink2URL: http://www.xilinx.com/support/documentation/user_guides/ug385.pdf; ComponentLink3Description: FGG484 Package Drawing; ComponentLink3URL: http://www.xilinx.com/support/documentation/package_specs/fg484.pdf; ComponentLink4Description: Spartan-6 Documents; ComponentLink4URL: http://www.xilinx.com/support/documentation/spartan-6.htm; ComponentLink5Description: Xilinx.com Home; ComponentLink5URL: http://www.xilinx.com
U6 = SPI FLASH 128Mb S25FL128P: SPI FLASH 128Mbit, 104MHz, 64kB sector; Full Part No: S25FL128P0XMFI00; Manufacturer: Spansion; Volts: 3.3V; ALS Lib: L0505; CLASS: IC; Type: SPI; Case: SOIC16
U7 U11 = SN74LVC00AD: Quadruple 2-Input Positive-NAND Gate; Published: 8-Jun-2000; LatestRevisionDate: 13-Apr-2006; LatestRevisionNote: IPC-7351 Footprint Added.; DatasheetVersion: Jun-1998; PackageVersion: Jan-1998; PackageReference: D014; Publisher: Altium Limited; PackageDescription: 14-Pin Small Outline Integrated Circuit 1.27 mm Pitch; Code_IPC: SOIC127P600-14; ComponentLink1Description: Manufacturer Link; ComponentLink1URL: http://www.ti.com/; ComponentLink2Description: Datasheet; ComponentLink2URL: http://www-s.ti.com/sc/ds/SN54LVC00A.pdf
U8 U12 = HFBR-1414
U13 U14 = MAX998ESA: Single, SOT23, Single-Supply, High-Speed, Low-Power Comparator; Published: 23-Sep-2002; LatestRevisionDate: 13-Apr-2006; LatestRevisionNote: IPC-7351 Footprint Added.; DatasheetVersion: Rev 1; 1/98; PackageReference: NSO8; Publisher: Altium Limited; PackageDescription: 8-Pin Small Outline Integrated Circuit 1.27 mm Pitch; Code_JEDEC: MS-012-AA; Code_IPC: SOIC127P600-8; ComponentLink1Description: Manufacturer Link; ComponentLink1URL: http://www.maxim-ic.com/; ComponentLink2Description: Datasheet; ComponentLink2URL: http://pdfserv.maxim-ic.com/en/ds/MAX976-MAX998.pdf
X2 = CON4: Connector

## Sheet Sheet5.SchDoc
size A3
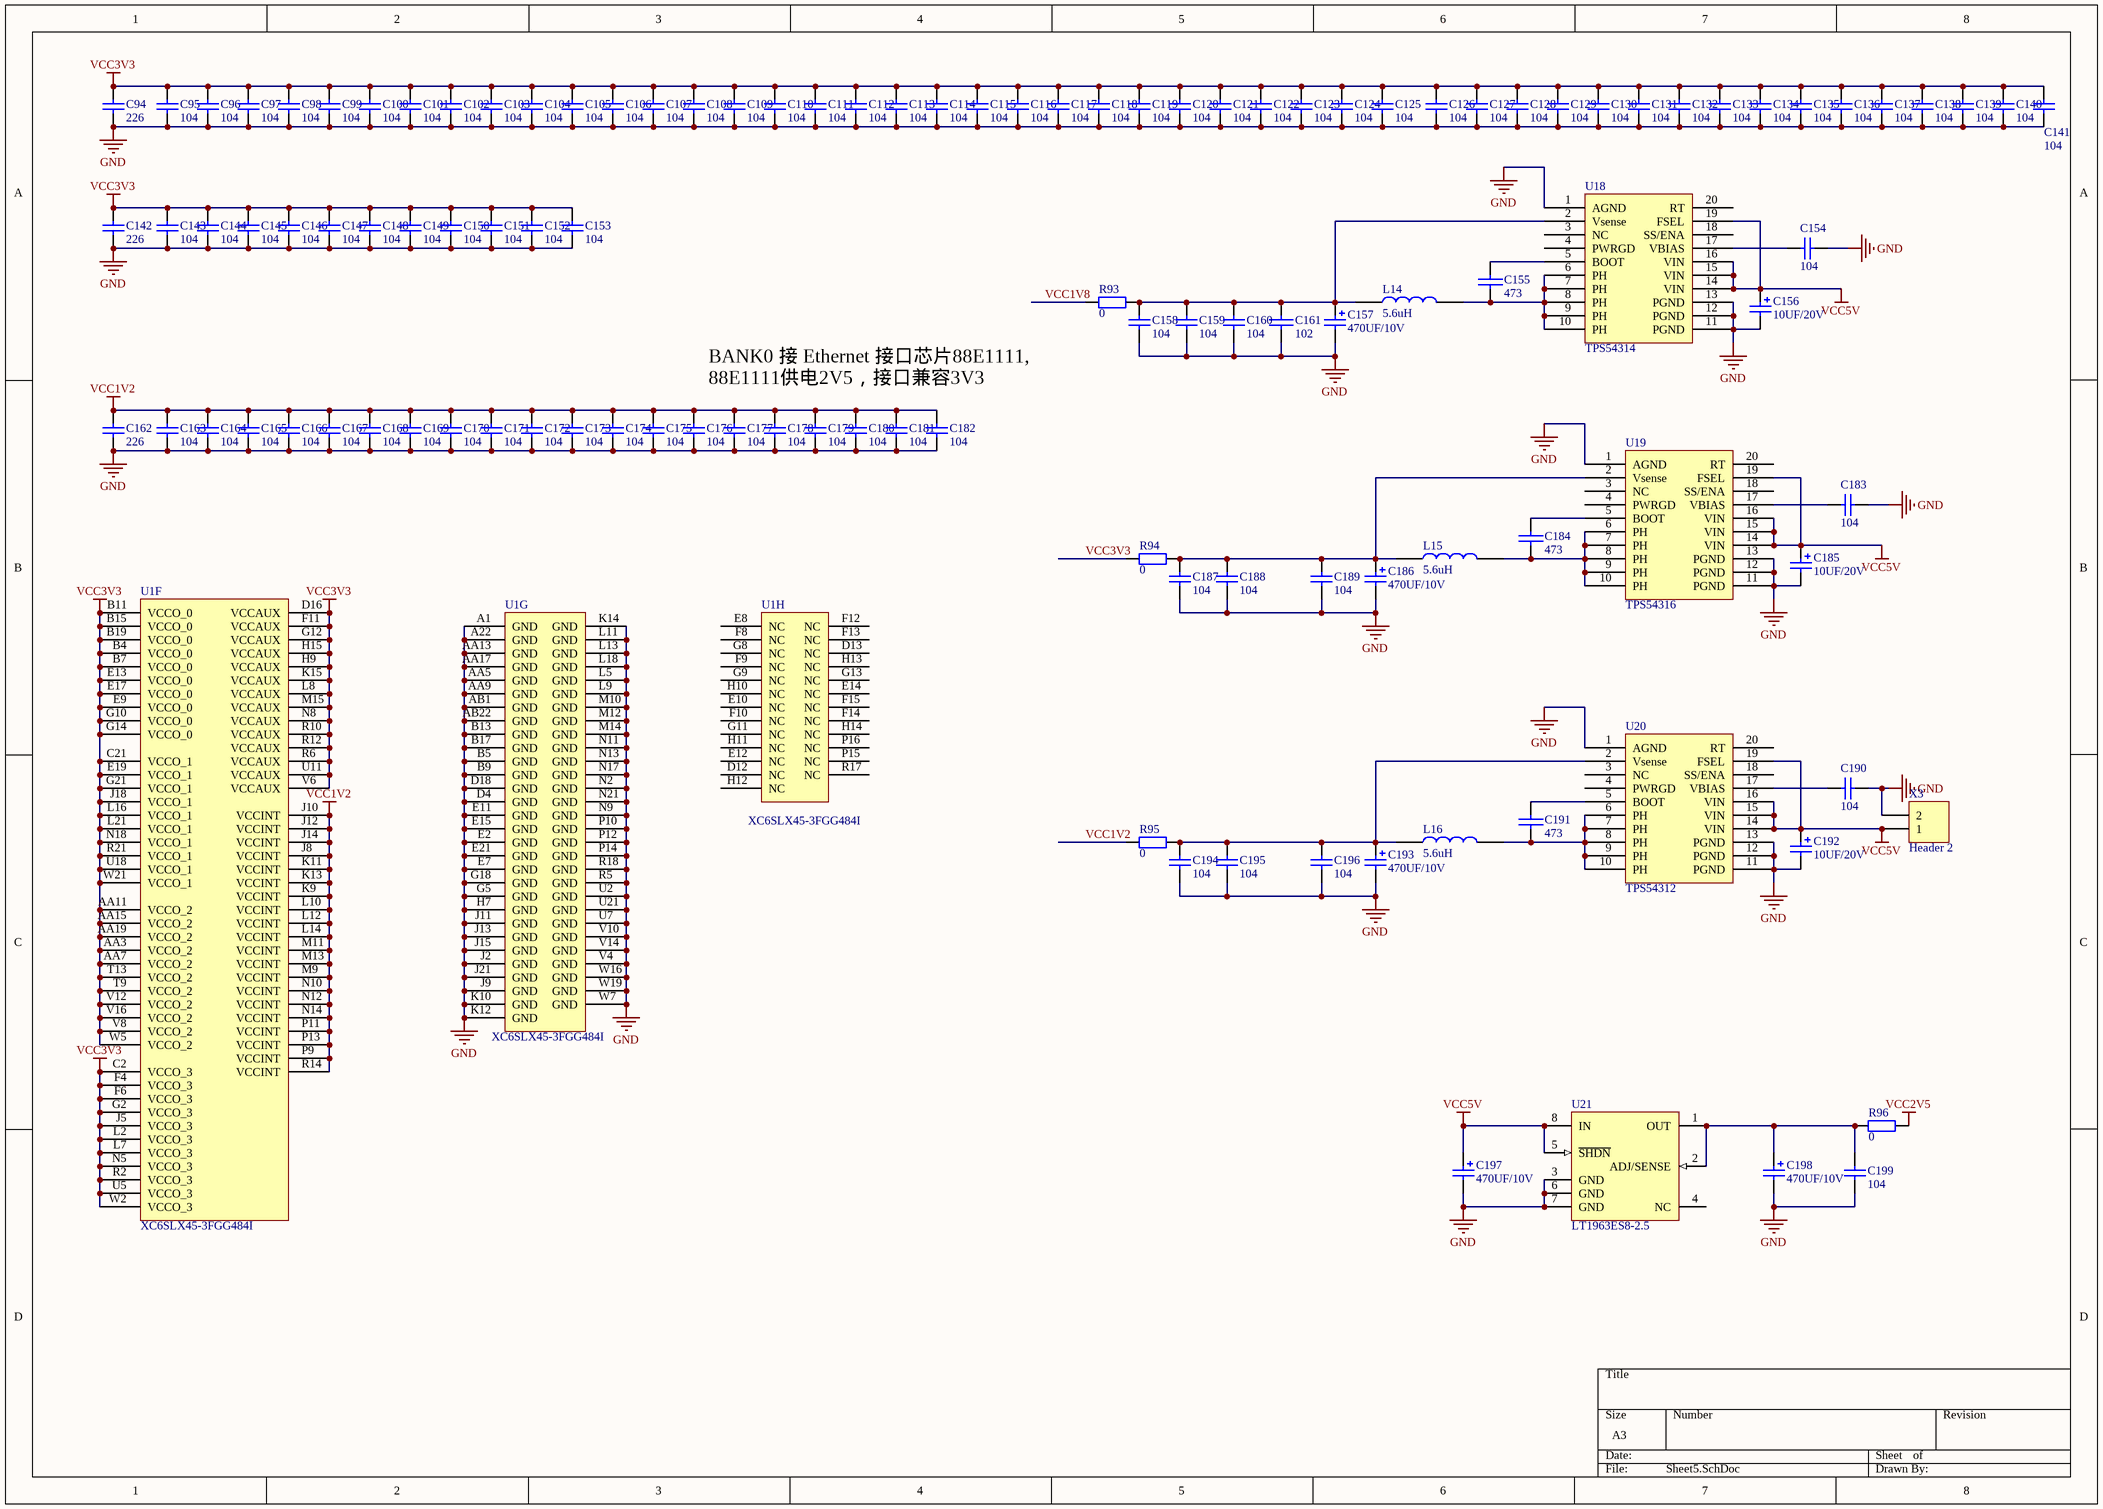
[diagram p2: Sheet5.SchDoc]

### Parts
C94  226  [0603]
C95  104  [0402]
C96  104  [0402]
C97  104  [0402]
C98  104  [0402]
C99  104  [0402]
C100  104  [0402]
C101  104  [0402]
C102  104  [0402]
C103  104  [0402]
C104  104  [0402]
C105  104  [0402]
C106  104  [0402]
C107  104  [0402]
C108  104  [0402]
C109  104  [0402]
C110  104  [0402]
C111  104  [0402]
C112  104  [0402]
C113  104  [0402]
C114  104  [0402]
C115  104  [0402]
C116  104  [0402]
C117  104  [0402]
C118  104  [0402]
C119  104  [0402]
C120  104  [0402]
C121  104  [0402]
C122  104  [0402]
C123  104  [0402]
C124  104  [0402]
C125  104  [0402]
C126  104  [0402]
C127  104  [0402]
C128  104  [0402]
C129  104  [0402]
C130  104  [0402]
C131  104  [0402]
C132  104  [0402]
C133  104  [0402]
C134  104  [0402]
C135  104  [0402]
C136  104  [0402]
C137  104  [0402]
C138  104  [0402]
C139  104  [0402]
C140  104  [0402]
C141  104  [0402]
C142  226  [0603]
C143  104  [0402]
C144  104  [0402]
C145  104  [0402]
C146  104  [0402]
C147  104  [0402]
C148  104  [0402]
C149  104  [0402]
C150  104  [0402]
C151  104  [0402]
C152  104  [0402]
C153  104  [0402]
C154  104  [0402]
C155  473  [0402]
C156  10UF/20V  [CAP-B]
C157  470UF/10V  [CAP-D]
C158  104  [0402]
C159  104  [0402]
C160  104  [0402]
C161  102  [0402]
C162  226  [0603]
C163  104  [0402]
C164  104  [0402]
C165  104  [0402]
C166  104  [0402]
C167  104  [0402]
C168  104  [0402]
C169  104  [0402]
C170  104  [0402]
C171  104  [0402]
C172  104  [0402]
C173  104  [0402]
C174  104  [0402]
C175  104  [0402]
C176  104  [0402]
C177  104  [0402]
C178  104  [0402]
C179  104  [0402]
C180  104  [0402]
C181  104  [0402]
C182  104  [0402]
C183  104  [0402]
C184  473  [0402]
C185  10UF/20V  [CAP-B]
C186  470UF/10V  [CAP-D]
C187  104  [0402]
C188  104  [0402]
C189  104  [0402]
C190  104  [0402]
C191  473  [0402]
C192  10UF/20V  [CAP-B]
C193  470UF/10V  [CAP-D]
C194  104  [0402]
C195  104  [0402]
C196  104  [0402]
C197  470UF/10V  [CAP-D]
C198  470UF/10V  [CAP-D]
C199  104  [0402]
L14  5.6uH  [L5R2]
L15  5.6uH  [L5R2]
L16  5.6uH  [L5R2]
R93  0  [0603]
R94  0  [0603]
R95  0  [0603]
R96  0  [0603]
U1  XC6SLX45-3FGG484I  [FGG484]  (parts F,G,H of 8)
U18  TPS54314  [SOP20]
U19  TPS54316  [SOP20]
U20  TPS54312  [SOP20]
U21  LT1963ES8-2.5  [so_8]
X3  Header 2  [HDR1X2]

### Nets
GND: C94.1 C95.1 C96.1 C97.1 C98.1 C99.1 C100.1 C101.1 C102.1 C103.1 C104.1 C105.1 C106.1 C107.1 C108.1 C109.1 C110.1 C111.1 C112.1 C113.1 C114.1 C115.1 C116.1 C117.1 C118.1 C119.1 C120.1 C121.1 C122.1 C123.1 C124.1 C125.1 C126.1 C127.1 C128.1 C129.1 C130.1 C131.1 C132.1 C133.1 C134.1 C135.1 C136.1 C137.1 C138.1 C139.1 C140.1 C141.1 C142.1 C143.1 C144.1 C145.1 C146.1 C147.1 C148.1 C149.1 C150.1 C151.1 C152.1 C153.1 C154.1 C156.2 C157.2 C158.1 C159.1 C160.1 C161.1 C162.1 C163.1 C164.1 C165.1 C166.1 C167.1 C168.1 C169.1 C170.1 C171.1 C172.1 C173.1 C174.1 C175.1 C176.1 C177.1 C178.1 C179.1 C180.1 C181.1 C182.1 C183.1 C185.2 C186.2 C187.1 C188.1 C189.1 C190.1 C192.2 C193.2 C194.1 C195.1 C196.1 C197.2 C198.2 C199.1 U1.A1(GND) U1.A22(GND) U1.AA5(GND) U1.AA9(GND) U1.AA13(GND) U1.AA17(GND) U1.AB1(GND) U1.AB22(GND) U1.B5(GND) U1.B9(GND) U1.B13(GND) U1.B17(GND) U1.D4(GND) U1.D18(GND) U1.E2(GND) U1.E7(GND) U1.E11(GND) U1.E15(GND) U1.E21(GND) U1.G5(GND) U1.G18(GND) U1.H7(GND) U1.J2(GND) U1.J9(GND) U1.J11(GND) U1.J13(GND) U1.J15(GND) U1.J21(GND) U1.K10(GND) U1.K12(GND) U1.K14(GND) U1.L5(GND) U1.L9(GND) U1.L11(GND) U1.L13(GND) U1.L18(GND) U1.M10(GND) U1.M12(GND) U1.M14(GND) U1.N2(GND) U1.N9(GND) U1.N11(GND) U1.N13(GND) U1.N17(GND) U1.N21(GND) U1.P10(GND) U1.P12(GND) U1.P14(GND) U1.R5(GND) U1.R18(GND) U1.U2(GND) U1.U7(GND) U1.U21(GND) U1.V4(GND) U1.V10(GND) U1.V14(GND) U1.W7(GND) U1.W16(GND) U1.W19(GND) U18.1(AGND) U18.11(PGND) U18.12(PGND) U18.13(PGND) U19.1(AGND) U19.11(PGND) U19.12(PGND) U19.13(PGND) U20.1(AGND) U20.11(PGND) U20.12(PGND) U20.13(PGND) U21.3(GND) U21.6(GND) U21.7(GND) X3.2
VCC1V2: C162.2 C163.2 C164.2 C165.2 C166.2 C167.2 C168.2 C169.2 C170.2 C171.2 C172.2 C173.2 C174.2 C175.2 C176.2 C177.2 C178.2 C179.2 C180.2 C181.2 C182.2 R95.2 U1.J8(VCCINT) U1.J10(VCCINT) U1.J12(VCCINT) U1.J14(VCCINT) U1.K9(VCCINT) U1.K11(VCCINT) U1.K13(VCCINT) U1.L10(VCCINT) U1.L12(VCCINT) U1.L14(VCCINT) U1.M9(VCCINT) U1.M11(VCCINT) U1.M13(VCCINT) U1.N10(VCCINT) U1.N12(VCCINT) U1.N14(VCCINT) U1.P9(VCCINT) U1.P11(VCCINT) U1.P13(VCCINT) U1.R14(VCCINT)
VCC2V5: R96.1
VCC3V3: C94.2 C95.2 C96.2 C97.2 C98.2 C99.2 C100.2 C101.2 C102.2 C103.2 C104.2 C105.2 C106.2 C107.2 C108.2 C109.2 C110.2 C111.2 C112.2 C113.2 C114.2 C115.2 C116.2 C117.2 C118.2 C119.2 C120.2 C121.2 C122.2 C123.2 C124.2 C125.2 C126.2 C127.2 C128.2 C129.2 C130.2 C131.2 C132.2 C133.2 C134.2 C135.2 C136.2 C137.2 C138.2 C139.2 C140.2 C141.2 C142.2 C143.2 C144.2 C145.2 C146.2 C147.2 C148.2 C149.2 C150.2 C151.2 C152.2 C153.2 R94.2 U1.AA3(VCCO_2) U1.AA7(VCCO_2) U1.AA11(VCCO_2) U1.AA15(VCCO_2) U1.AA19(VCCO_2) U1.B4(VCCO_0) U1.B7(VCCO_0) U1.B11(VCCO_0) U1.B15(VCCO_0) U1.B19(VCCO_0) U1.C2(VCCO_3) U1.C21(VCCO_1) U1.D16(VCCAUX) U1.E9(VCCO_0) U1.E13(VCCO_0) U1.E17(VCCO_0) U1.E19(VCCO_1) U1.F4(VCCO_3) U1.F6(VCCO_3) U1.F11(VCCAUX) U1.G2(VCCO_3) U1.G10(VCCO_0) U1.G12(VCCAUX) U1.G14(VCCO_0) U1.G21(VCCO_1) U1.H9(VCCAUX) U1.H15(VCCAUX) U1.J5(VCCO_3) U1.J18(VCCO_1) U1.K15(VCCAUX) U1.L2(VCCO_3) U1.L7(VCCO_3) U1.L8(VCCAUX) U1.L16(VCCO_1) U1.L21(VCCO_1) U1.M15(VCCAUX) U1.N5(VCCO_3) U1.N8(VCCAUX) U1.N18(VCCO_1) U1.R2(VCCO_3) U1.R6(VCCAUX) U1.R10(VCCAUX) U1.R12(VCCAUX) U1.R21(VCCO_1) U1.T9(VCCO_2) U1.T13(VCCO_2) U1.U5(VCCO_3) U1.U11(VCCAUX) U1.U18(VCCO_1) U1.V6(VCCAUX) U1.V8(VCCO_2) U1.V12(VCCO_2) U1.V16(VCCO_2) U1.W2(VCCO_3) U1.W5(VCCO_2) U1.W21(VCCO_1)
VCC5V: C156.1 C185.1 C192.1 C197.1 U18.14(VIN) U18.15(VIN) U18.16(VIN) U18.19(FSEL) U19.14(VIN) U19.15(VIN) U19.16(VIN) U19.19(FSEL) U20.14(VIN) U20.15(VIN) U20.16(VIN) U20.19(FSEL) U21.5(~{SHDN}) U21.8(IN) X3.1
VCC1V8: R93.2
NetC154_2: C154.2 U18.17(VBIAS)
NetC155_1: C155.1 L14.2 U18.6(PH) U18.7(PH) U18.8(PH) U18.9(PH) U18.10(PH)
NetC155_2: C155.2 U18.5(BOOT)
NetC157_1: C157.1 C158.2 C159.2 C160.2 C161.2 L14.1 R93.1 U18.2(Vsense)
NetC183_2: C183.2 U19.17(VBIAS)
NetC184_1: C184.1 L15.2 U19.6(PH) U19.7(PH) U19.8(PH) U19.9(PH) U19.10(PH)
NetC184_2: C184.2 U19.5(BOOT)
NetC186_1: C186.1 C187.2 C188.2 C189.2 L15.1 R94.1 U19.2(Vsense)
NetC190_2: C190.2 U20.17(VBIAS)
NetC191_1: C191.1 L16.2 U20.6(PH) U20.7(PH) U20.8(PH) U20.9(PH) U20.10(PH)
NetC191_2: C191.2 U20.5(BOOT)
NetC193_1: C193.1 C194.2 C195.2 C196.2 L16.1 R95.1 U20.2(Vsense)
NetC198_1: C198.1 C199.2 R96.2 U21.1(OUT) U21.2(ADJ/SENSE)

Not connected (* = marked no-connect by the designer): U1 D12(NC) D13(NC) E8(NC) E10(NC) E12(NC) E14(NC) F8(NC) F9(NC) F10(NC) F12(NC) F13(NC) F14(NC) F15(NC) G8(NC) G9(NC) G11(NC) G13(NC) H10(NC) H11(NC) H12(NC) H13(NC) H14(NC) P15(NC) P16(NC) R17(NC); U18 3(NC) 4(PWRGD) 18(SS/ENA) 20(RT); U19 3(NC) 4(PWRGD) 18(SS/ENA) 20(RT); U20 3(NC) 4(PWRGD) 18(SS/ENA) 20(RT); U21 4(NC)

### Notes on the sheet
- BANK0 接 Ethernet 接口芯片88E1111, 88E1111供电2V5，接口兼容3V3

### Library data of the parts
C94-C154 C158-C160 C162-C183 C187-C190 C194-C196 C199 = Cap: Capacitor; Value: 0.1uF; Published: 8-Jun-2000; LatestRevisionDate: 17-Jul-2002; LatestRevisionNote: Re-released for DXP Platform.; PackageReference: RAD-0.3; Publisher: Altium Limited
C155 C161 C184 C191 = CAP: Capacitor
C156 C157 C185 C186 C192 C193 C197 C198 = Cap Pol2: as C39 on sheet Sheet2; Published: 8-Jun-2000; LatestRevisionDate: 17-Jul-2002; LatestRevisionNote: Re-released for DXP Platform.; PackageReference: POLAR0.8; Publisher: Altium Limited
L14-L16 = INDUCTOR1
R93-R96 = Res2: Resistor; Value: 47R; Published: 8-Jun-2000; LatestRevisionDate: 17-Jul-2002; LatestRevisionNote: Re-released for DXP Platform.; PackageReference: AXIAL-0.4; Publisher: Altium Limited
U1 = XC6SLX45-3FGG484I: as U1 on sheet Sheet2; FirstPublished: 17-Nov-2009; DatasheetVersion: ver1.3, Nov-2009; PackageVersion: ver1.1, Dec-2008; PackageReference: FGG484; Publisher: Altium Limited; PackageDescription: 484-Ball Fine Pitch Ball Grid Array 1.00 mm Pitch (FGG484) - Pb-Free; Code_JEDEC: MS-034-AAJ-1; Code_IPC: BGA100P22X22-484; ComponentLink1Description: Spartan-6 Datasheet; ComponentLink1URL: http://www.xilinx.com/support/documentation/data_sheets/ds160.pdf; ComponentLink2Description: Pinout Specification; ComponentLink2URL: http://www.xilinx.com/support/documentation/user_guides/ug385.pdf; ComponentLink3Description: FGG484 Package Drawing; ComponentLink3URL: http://www.xilinx.com/support/documentation/package_specs/fg484.pdf; ComponentLink4Description: Spartan-6 Documents; ComponentLink4URL: http://www.xilinx.com/support/documentation/spartan-6.htm; ComponentLink5Description: Xilinx.com Home; ComponentLink5URL: http://www.xilinx.com
U18 U19 = TPS54312
U21 = LT1962EMS8: 300mA, Low Noise, Micropower Low Dropout Regulator; Note: 1916; Published: 30-May-2008; DatasheetVersion: Aug-2007; PackageVersion: revA, 2000; PackageReference: MS8; Publisher: Altium Limited; PackageDescription: 8-Pin Thin Small Outline Package 0.65 mm Pitch; ComponentLink1Description: Manufacturer Link; ComponentLink1URL: http://www.linear.com/; ComponentLink2Description: Datasheet; ComponentLink2URL: http://www.linear.com/pc/downloadDocument.do?navId=H0,C1,C1003,C1040,C1055,P1378,D3343
X3 = Header 2: Header, 2-Pin; LatestRevisionDate: 17-Jul-2002; LatestRevisionNote: Re-released for DXP Platform.; Publisher: Altium Limited

## Nets that join several sheets
GND: Sheet2 (42 pins), Sheet3 (55 pins), Sheet5 (178 pins)
VCC3V3: Sheet2 (30 pins), Sheet3 (22 pins), Sheet5 (117 pins)
VCC5V: Sheet2 (D8.2 D9.2 L3.2 R35.2), Sheet3 (8 pins), Sheet5 (19 pins)